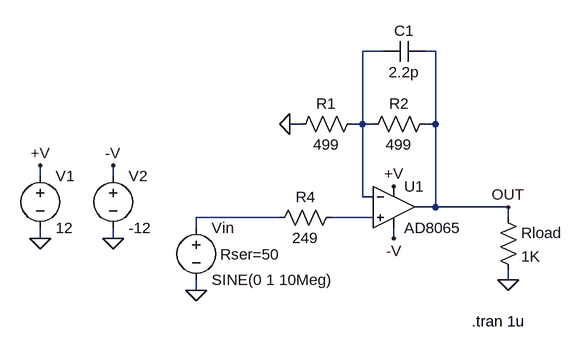
[diagram p0: schematic AD8065.asc]
AD8065.asc, the LTspice schematic file:
Version 4
SHEET 1 1240 700
WIRE 560 -1344 528 -1344
WIRE 640 -1344 624 -1344
WIRE 432 -1232 416 -1232
WIRE 528 -1232 528 -1344
WIRE 528 -1232 512 -1232
WIRE 544 -1232 528 -1232
WIRE 640 -1232 640 -1344
WIRE 640 -1232 624 -1232
WIRE 32 -1152 32 -1168
WIRE 144 -1152 144 -1168
WIRE 528 -1120 528 -1232
WIRE 544 -1120 528 -1120
WIRE 640 -1104 640 -1232
WIRE 640 -1104 608 -1104
WIRE 752 -1104 640 -1104
WIRE 400 -1088 272 -1088
WIRE 544 -1088 480 -1088
WIRE 752 -1088 752 -1104
WIRE 272 -1072 272 -1088
WIRE 32 -1056 32 -1072
WIRE 144 -1056 144 -1072
WIRE 576 -1056 576 -1072
WIRE 752 -992 752 -1008
WIRE 272 -976 272 -992
FLAG 32 -1168 +V
FLAG 272 -976 0
FLAG 752 -1104 OUT
FLAG 576 -1136 +V
FLAG 144 -1168 -V
FLAG 576 -1056 -V
FLAG 416 -1232 0
FLAG 752 -992 0
FLAG 144 -1056 0
FLAG 32 -1056 0
SYMBOL voltage 32 -1168 R0
WINDOW 123 0 0 Left 2
WINDOW 39 0 0 Left 2
SYMATTR InstName V1
SYMATTR Value 12
SYMBOL voltage 272 -1088 R0
WINDOW 123 24 138 Left 2
WINDOW 39 37 57 Left 2
SYMATTR SpiceLine Rser=50
SYMATTR InstName Vin
SYMATTR Value SINE(0 1 10Meg)
SYMBOL res 528 -1248 R90
WINDOW 0 0 56 VBottom 2
WINDOW 3 32 56 VTop 2
SYMATTR InstName R1
SYMATTR Value 499
SYMBOL res 640 -1248 R90
WINDOW 0 0 56 VBottom 2
WINDOW 3 32 56 VTop 2
SYMATTR InstName R2
SYMATTR Value 499
SYMBOL Opamps\\AD8065 576 -1168 R0
SYMATTR InstName U1
SYMBOL voltage 144 -1168 R0
WINDOW 123 24 146 Left 2
WINDOW 39 24 125 Left 2
SYMATTR InstName V2
SYMATTR Value -12
SYMBOL res 736 -1104 R0
SYMATTR InstName Rload
SYMATTR Value 1K
SYMBOL res 496 -1104 R90
WINDOW 0 0 56 VBottom 2
WINDOW 3 32 56 VTop 2
SYMATTR InstName R4
SYMATTR Value 249
SYMBOL cap 624 -1360 R90
WINDOW 0 0 32 VBottom 2
WINDOW 3 32 32 VTop 2
SYMATTR InstName C1
SYMATTR Value 2.2p
TEXT 696 -928 Left 2 !.tran 1u

The netlist it stands for:
* AD8065.asc
V1 +V 0 12
Vin N002 0 SINE(0 1 10Meg) Rser=50
R1 N001 0 499
R2 OUT N001 499
XU1 N003 N001 +V -V OUT AD8065  ; pins In+ In- V+ V- OUT
V2 -V 0 -12
Rload OUT 0 1K
R4 N003 N002 249
C1 OUT N001 2.2p
.tran 1u
.backanno
.end